# Altium schematic sheet Sheet2.SchDoc
size B; ENG_APP_DATE: --/--/--; DSN_APP_DATE: --/--/--; CHK_APP_DATE: --/--/--
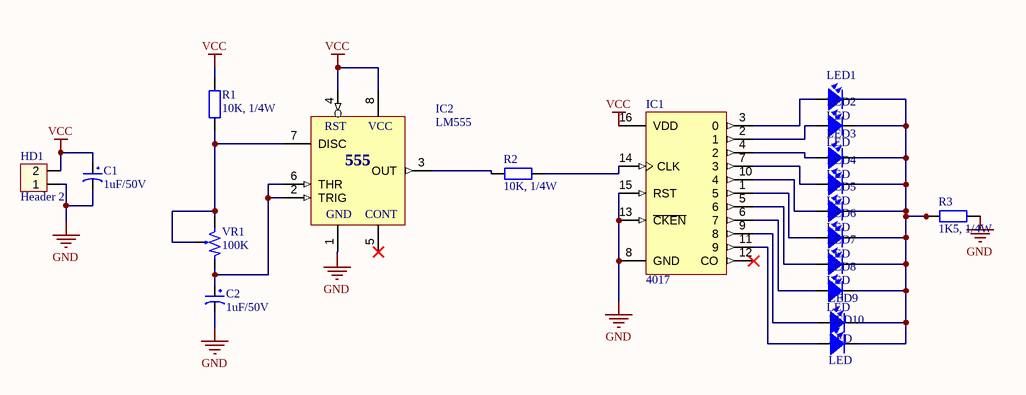
[diagram p0: Sheet2.SchDoc]

## Parts
C1  1uF/50V  [CP1/2]
C2  1uF/50V  [CP1/2]
HD1  Header 2  [HED2]
IC1  4017  [DIP16/W0.3]
IC2  LM555  [DIP8/W0.3]
LED1  LED  [LED-3]
LED2  LED  [LED-3]
LED3  LED  [LED-3]
LED4  LED  [LED-3]
LED5  LED  [LED-3]
LED6  LED  [LED-3]
LED7  LED  [LED-3]
LED8  LED  [LED-3]
LED9  LED  [LED-3]
LED10  LED  [LED-3]
R1  10K, 1/4W  [R1/4W]
R2  10K, 1/4W  [R1/4W]
R3  1K5, 1/4W  [R1/4W]
VR1  100K  [VR]

## Nets
GND: C1.2 C2.2 HD1.1 IC1.8(GND) IC1.13(~{CKEN}) IC1.15(RST) IC2.1(GND) R3.2
VCC: C1.1 HD1.2 IC1.16(VDD) IC2.4(RST) IC2.8(VCC) R1.2
NetC2_1: C2.1 IC2.2(TRIG) IC2.6(THR) VR1.1
NetIC1_1: IC1.1(5) LED6.1
NetIC1_2: IC1.2(1) LED2.1
NetIC1_3: IC1.3(0) LED1.1
NetIC1_4: IC1.4(2) LED3.1
NetIC1_5: IC1.5(6) LED7.1
NetIC1_6: IC1.6(7) LED8.1
NetIC1_7: IC1.7(3) LED4.1
NetIC1_9: IC1.9(8) LED9.1
NetIC1_10: IC1.10(4) LED5.1
NetIC1_11: IC1.11(9) LED10.1
NetIC1_14: IC1.14(CLK) R2.2
NetIC2_3: IC2.3(OUT) R2.1
NetIC2_7: IC2.7(DISC) R1.1 VR1.2 VR1.3
NetLED1_2: LED1.2 LED2.2 LED3.2 LED4.2 LED5.2 LED6.2 LED7.2 LED8.2 LED9.2 LED10.2 R3.1

Not connected (* = marked no-connect by the designer): IC1 12(CO)*; IC2 5(CONT)*

## Notes on the sheet
- DWG. NO.
- REV.
- SHT.
- THIS DOCUMENT AND THE DATA DISCLOSED HEREIN OR HEREWITH IS THE PROPERTY OF ALTIUM LIMITED AND MAY BE FREELY DISTRIBUTED IN WHOLE. NO RIGHTS ARE RESERVED OR EXPRESS OR IMPLIED WARANTEE GIVEN.
- REVISION
- DESCRIPTION
- DATE
- APPROVED
- ENG:
- APPROVALS
- PROJECT
- DSN:
- CHK:
- REFERENCE DOCUMENTS
- PROJECT REVISION:
- TITLE
- DOCUMENT REVISION:
- DESIGN ITEM:
- BOM:
- FAB DWG:
- PCB DWG:
- ASSY DWG:
- SCALE:
- SIZE
- B
- CAGE CODE
- FILE NAME
- DWG NO.
- SHEET
- OF
- REV
- (in symbol LM555) 555

## Library data of the parts
C1 C2 = CP1: Cap P  0,1uF < 22uF , 16 - 50V; Value: 10uF/50V; Description 1: 10 => 220uF/6,3V/10V - 10uF => 100uF/16V; Description 2: 0,1uF => 33uF/50V - 10uF => 22uF/63V; Description 3: 0,47uF => 10uF/100V
HD1 = Hed2: Header 2 (Green); Value: Header 2
IC1 = 4017: Decade Counter/Divider with 10 Decoded Outputs; Designed by: VanDungEvn; Value: CD4017
IC2 = LM555: Timer; Value: LM555
LED1-LED10 = LED: LED Single colour Green and Red; Value: LED 3 ly Single Colour
R1-R3 = R1/4W: Resistor 1/4W; Value: R1/4W - 1K
VR1 = VR1: Var Resistor; Value: VR 10K